# EAGLE schematic DistributedVisionSchematicFINALsch (EAGLE 9.6.2)

## Sheet 1 of 4: Page 1
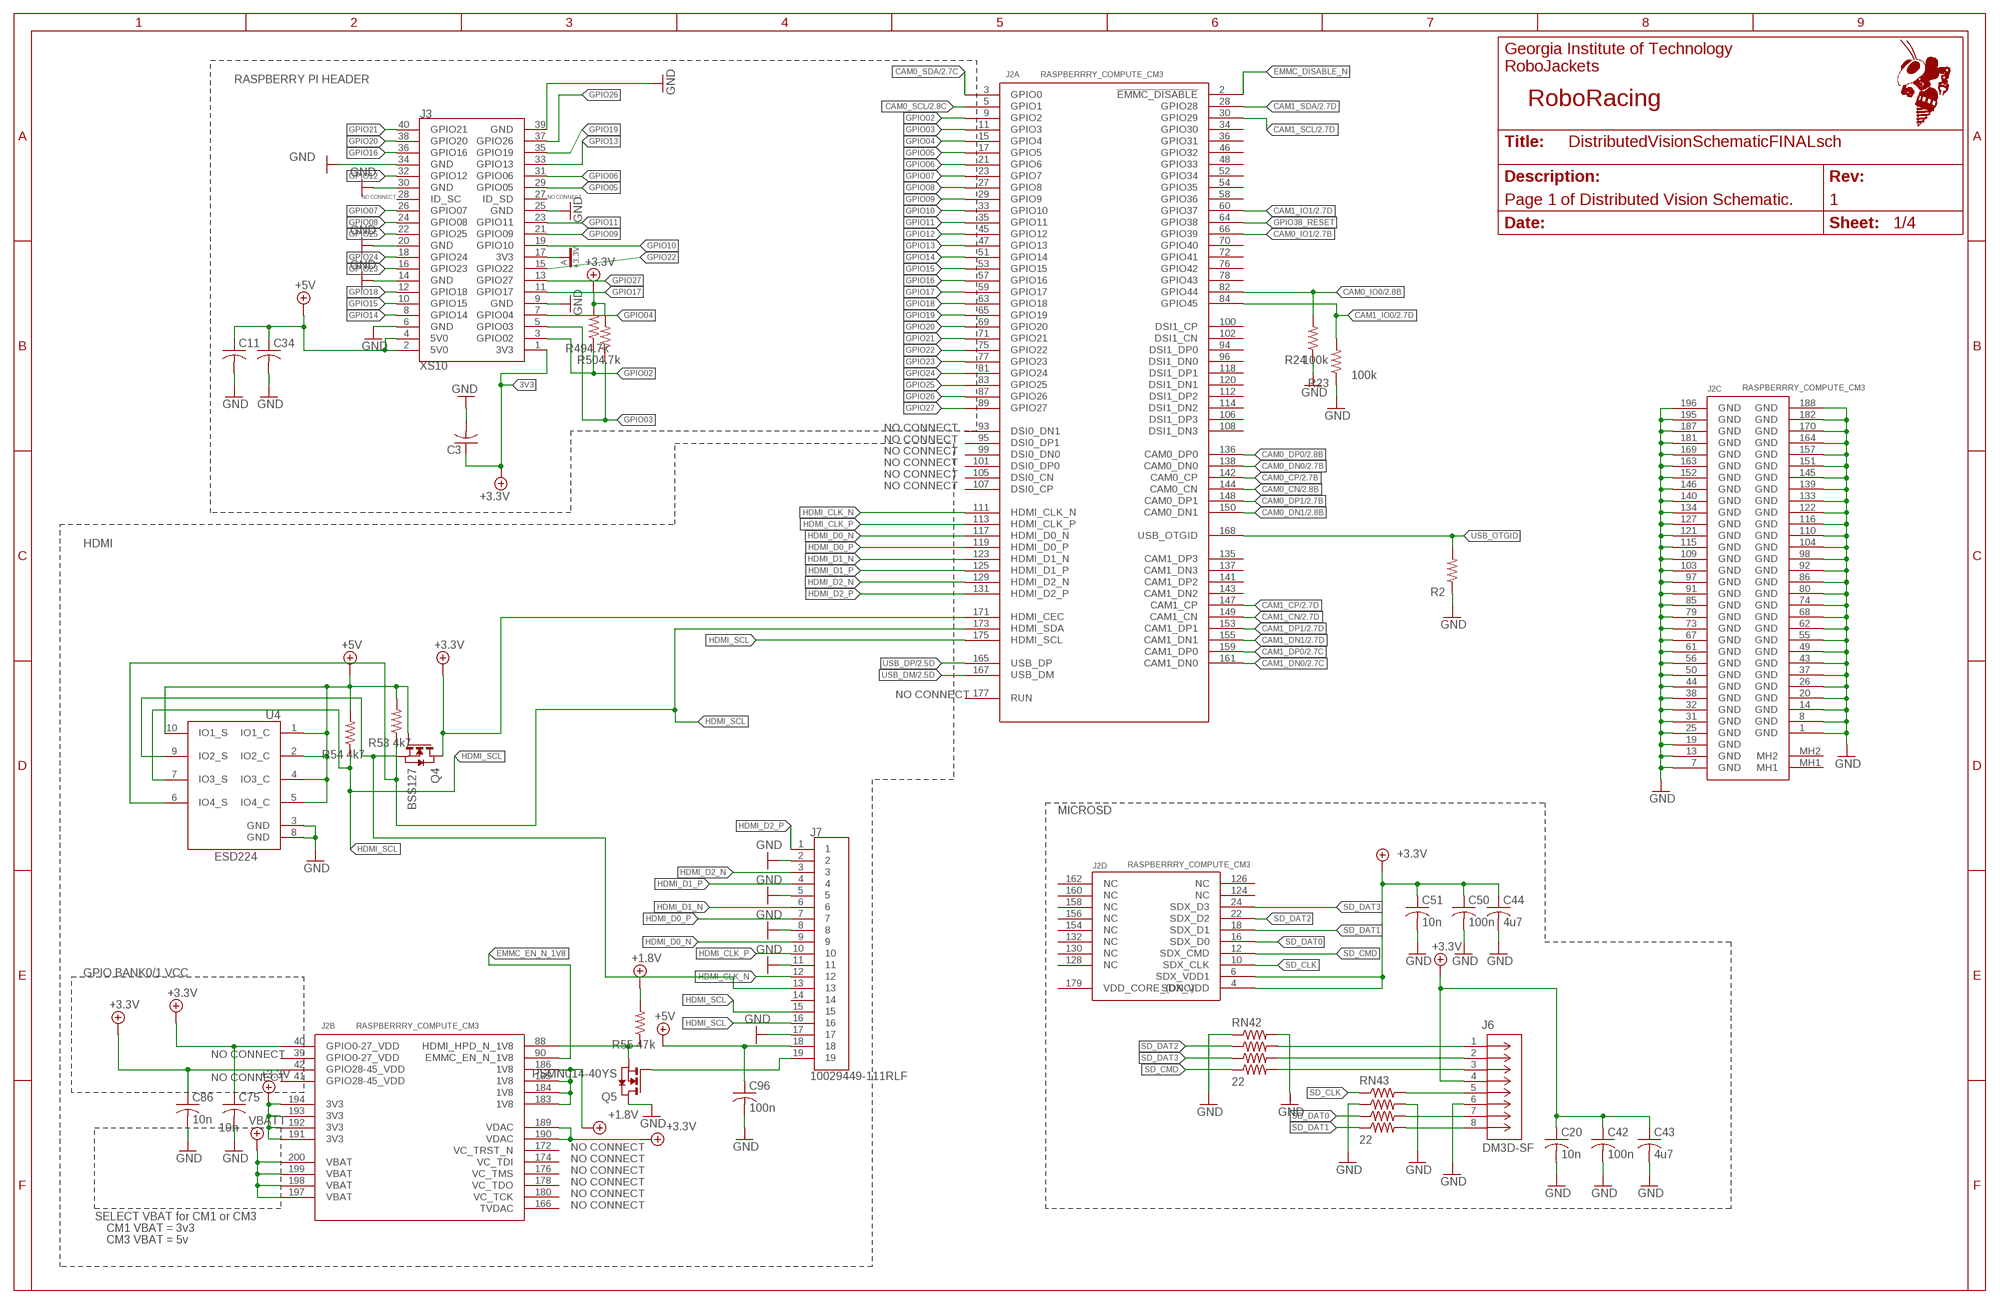
[diagram p0: schematic, sheet 1]
FRAME3 (FRAME_11_17): REVISION: 1; SCH_DESC: Page 1 of Distributed Vision Schematic.; TEAM: RoboRacing

### Parts
C3  C-USC0603  [C0603]
C11  C-USC0603  [C0603]
C20  10n  C-USC0603  [C0603]
C34  C-USC0603  [C0603]
C42  100n  C-USC0603  [C0603]
C43  4u7  C-USC0603  [C0603]
C44  4u7  C-USC0603  [C0603]
C50  100n  C-USC0603  [C0603]
C51  10n  C-USC0603  [C0603]
C75  10n  C-USC0603  [C0603]
C86  10n  C-USC0603  [C0603]
C96  100n  C-USC0603  [C0603]
J2  RASPBERRRY_COMPUTE_CM3  [TE_1473149-4_WITH_CM3PLUS]
J3  XS10  [RASPBERRYPI_BASTELSTUBE_V13_RASPI_BOARD_B+_FULL]
J6  DM3D-SF  [CONN8_DM3D-SF_HIR]
J7  10029449-111RLF  [CONN_1002944111_AMP]
Q4  BSS127  [SOT-23-3]
Q5  PSMN014-40YS  [LFPAK]
R2  R-US_R0603  [R0603]
R23  100k  R-US_R0603  [R0603]
R24  100k  R-US_R0603  [R0603]
R49  4.7k  R-US_R0603  [R0603]
R50  4.7k  R-US_R0603  [R0603]
R53  4k7  R-US_R0603  [R0603]
R54  4k7  R-US_R0603  [R0603]
R55  47k  R-US_R0603  [R0603]
RN42  22  RA-41206  [RA-4_1206]
RN43  22  RA-41206  [RA-4_1206]
U4  ESD224  [USON(10)]

### Nets
3V3: C3.1 J3.1(3V3) ; supply symbol labelled +3.3V
+1.8V: J2.183(B:1V8) J2.184(B:1V8) J2.185(B:1V8) J2.186(B:1V8) R55.2 ; also sheet 3
+3.3V: J2.171(A:HDMI_CEC) J2.189(B:VDAC) J2.190(B:VDAC) Q4.3(D) ; also sheet 2,3,4
+3.3V-A: J3.17(3V3) ; supply symbol labelled SUP ; also sheet 3
+5V: C11.1 C34.1 C96.1 J3.2(5V0) J3.4(5V0) J7.18 Q4.1(G) R53.2 R54.2 U4.1(IO1_C) U4.2(IO2_C) U4.4(IO3_C) U4.5(IO4_C) U4.10(IO1_S) ; also sheet 2,3,4
BD+: J2.88(B:HDMI_HPD_N_1V8) Q5.1(S) Q5.2(S) Q5.3(S) R55.1 ; also sheet 2
CAM0_CN: J2.144(A:CAM0_CN) ; also sheet 2
CAM0_CP: J2.142(A:CAM0_CP) ; also sheet 2
CAM0_DN0: J2.138(A:CAM0_DN0) ; also sheet 2
CAM0_DN1: J2.150(A:CAM0_DN1) ; also sheet 2
CAM0_DP0: J2.136(A:CAM0_DP0) ; also sheet 2
CAM0_DP1: J2.148(A:CAM0_DP1) ; also sheet 2
CAM0_IO0: J2.82(A:GPIO44) R24.2 ; also sheet 2
CAM0_IO1: J2.66(A:GPIO39) ; also sheet 2
CAM0_SCL: J2.5(A:GPIO1) ; also sheet 2
CAM0_SDA: J2.3(A:GPIO0) ; also sheet 2
CAM1_CN: J2.149(A:CAM1_CN) ; also sheet 2
CAM1_CP: J2.147(A:CAM1_CP) ; also sheet 2
CAM1_DN0: J2.161(A:CAM1_DN0) ; also sheet 2
CAM1_DN1: J2.155(A:CAM1_DN1) ; also sheet 2
CAM1_DP0: J2.159(A:CAM1_DP0) ; also sheet 2
CAM1_DP1: J2.153(A:CAM1_DP1) ; also sheet 2
CAM1_IO0: J2.84(A:GPIO45) R23.2 ; also sheet 2
CAM1_IO1: J2.60(A:GPIO37) ; also sheet 2
CAM1_SCL: J2.30(A:GPIO29) ; also sheet 2
CAM1_SDA: J2.28(A:GPIO28) ; also sheet 2
EMMC_DISABLE_N: J2.2(A:!EMMC_DISABLE)
EMMC_EN_N_1V8: J2.90(B:EMMC_EN_N_1V8)
FB1: C20.1 C42.1 C43.1 C44.1 C50.1 C51.1 C75.1 C86.1 J2.4(D:SDX_VDD) J2.6(D:SDX_VDD1) J2.40(B:GPIO0-27_VDD) J2.42(B:GPIO28-45_VDD) J2.191(B:3V3) J2.192(B:3V3) J2.193(B:3V3) J2.194(B:3V3) J6.4 R49.2 R50.2 ; supply symbol labelled +3.3V ; also sheet 3
GND: C3.2 C11.2 C20.2 C34.2 C42.2 C43.2 C44.2 C50.2 C51.2 C75.2 C86.2 C96.2 J2.1(C:GND) J2.7(C:GND) J2.8(C:GND) J2.13(C:GND) J2.14(C:GND) J2.19(C:GND) J2.20(C:GND) J2.25(C:GND) J2.26(C:GND) J2.31(C:GND) J2.32(C:GND) J2.37(C:GND) J2.38(C:GND) J2.43(C:GND) J2.44(C:GND) J2.49(C:GND) J2.50(C:GND) J2.55(C:GND) J2.56(C:GND) J2.61(C:GND) J2.62(C:GND) J2.67(C:GND) J2.68(C:GND) J2.73(C:GND) J2.74(C:GND) J2.79(C:GND) J2.80(C:GND) J2.85(C:GND) J2.86(C:GND) J2.91(C:GND) J2.92(C:GND) J2.97(C:GND) J2.98(C:GND) J2.103(C:GND) J2.104(C:GND) J2.109(C:GND) J2.110(C:GND) J2.115(C:GND) J2.116(C:GND) J2.121(C:GND) J2.122(C:GND) J2.127(C:GND) J2.133(C:GND) J2.134(C:GND) J2.139(C:GND) J2.140(C:GND) J2.145(C:GND) J2.146(C:GND) J2.151(C:GND) J2.152(C:GND) J2.157(C:GND) J2.163(C:GND) J2.164(C:GND) J2.169(C:GND) J2.170(C:GND) J2.181(C:GND) J2.182(C:GND) J2.187(C:GND) J2.188(C:GND) J2.195(C:GND) J2.196(C:GND) J3.6(GND) J3.9(GND) J3.14(GND) J3.20(GND) J3.25(GND) J3.30(GND) J3.34(GND) J3.39(GND) J6.6 J7.2 J7.5 J7.8 J7.11 J7.17 Q5.MB(D) R2.1 R23.1 R24.1 RN42.1 RN42.2 RN43.3 RN43.4 U4.3(GND) U4.8(GND) ; also sheet 2,3,4
GPIO02: J2.9(A:GPIO2) J3.3(GPIO02) R49.1
GPIO03: J2.11(A:GPIO3) J3.5(GPIO03) R50.1
GPIO04: J2.15(A:GPIO4) J3.7(GPIO04)
GPIO05: J2.17(A:GPIO5) J3.29(GPIO05)
GPIO06: J2.21(A:GPIO6) J3.31(GPIO06)
GPIO07: J2.23(A:GPIO7) J3.26(GPIO07)
GPIO08: J2.27(A:GPIO8) J3.24(GPIO08)
GPIO09: J2.29(A:GPIO9) J3.21(GPIO09)
GPIO10: J2.33(A:GPIO10) J3.19(GPIO10)
GPIO11: J2.35(A:GPIO11) J3.23(GPIO11)
GPIO12: J2.45(A:GPIO12) J3.32(GPIO12)
GPIO13: J2.47(A:GPIO13) J3.33(GPIO13)
GPIO14: J2.51(A:GPIO14) J3.8(GPIO14)
GPIO15: J2.53(A:GPIO15) J3.10(GPIO15)
GPIO16: J2.57(A:GPIO16) J3.36(GPIO16)
GPIO17: J2.59(A:GPIO17) J3.11(GPIO17)
GPIO18: J2.63(A:GPIO18) J3.12(GPIO18)
GPIO19: J2.65(A:GPIO19) J3.35(GPIO19)
GPIO20: J2.69(A:GPIO20) J3.38(GPIO20)
GPIO21: J2.71(A:GPIO21) J3.40(GPIO21)
GPIO22: J2.75(A:GPIO22) J3.15(GPIO22)
GPIO23: J2.77(A:GPIO23) J3.16(GPIO23)
GPIO24: J2.81(A:GPIO24) J3.18(GPIO24)
GPIO25: J2.83(A:GPIO25) J3.22(GPIO25)
GPIO26: J2.87(A:GPIO26) J3.37(GPIO26)
GPIO27: J2.89(A:GPIO27) J3.13(GPIO27)
GPIO38_RESET: J2.64(A:GPIO38)
HDMI_CLK_N: J2.111(A:HDMI_CLK_N) J7.12
HDMI_CLK_P: J2.113(A:HDMI_CLK_P) J7.10
HDMI_D0_N: J2.117(A:HDMI_D0_N) J7.9
HDMI_D0_P: J2.119(A:HDMI_D0_P) J7.7
HDMI_D1_N: J2.123(A:HDMI_D1_N) J7.6
HDMI_D1_P: J2.125(A:HDMI_D1_P) J7.4
HDMI_D2_N: J2.129(A:HDMI_D2_N) J7.3
HDMI_D2_P: J2.131(A:HDMI_D2_P) J7.1
HDMI_SCL: J2.173(A:HDMI_SDA) J2.175(A:HDMI_SCL) J7.15 J7.16 R53.1 R54.1 U4.6(IO4_S) U4.7(IO3_S)
N$45: J7.19 Q5.4(G)
N$46: J6.1 RN42.4
N$47: J6.2 RN42.6
N$48: J6.3 RN42.8
N$49: J6.5 RN43.2
N$50: J6.7 RN43.6
N$51: J6.8 RN43.8
N$53: J7.13 Q4.2(S) U4.9(IO2_S)
SD_CLK: J2.10(D:SDX_CLK) RN43.1
SD_CMD: J2.12(D:SDX_CMD) RN42.7
SD_DAT0: J2.16(D:SDX_D0) RN43.5
SD_DAT1: J2.18(D:SDX_D1) RN43.7
SD_DAT2: J2.22(D:SDX_D2) RN42.3
SD_DAT3: J2.24(D:SDX_D3) RN42.5
USB_DM: J2.167(A:USB_DM) ; also sheet 2
USB_DP: J2.165(A:USB_DP) ; also sheet 2
USB_OTGID: J2.168(A:USB_OTGID) R2.2
VBATT: J2.197(B:VBAT) J2.198(B:VBAT) J2.199(B:VBAT) J2.200(B:VBAT) ; also sheet 3
Unconnected: J2.34(A:GPIO30) J2.36(A:GPIO31) J2.46(A:GPIO32) J2.48(A:GPIO33) J2.52(A:GPIO34) J2.54(A:GPIO35) J2.58(A:GPIO36) J2.70(A:GPIO40) J2.72(A:GPIO41) J2.76(A:GPIO42) J2.78(A:GPIO43) J2.93(A:DSI0_DN1) J2.94(A:DSI1_DP0) J2.95(A:DSI0_DP1) J2.96(A:DSI1_DN0) J2.99(A:DSI0_DN0) J2.100(A:DSI1_CP) J2.101(A:DSI0_DP0) J2.102(A:DSI1_CN) J2.105(A:DSI0_CN) J2.106(A:DSI1_DP3) J2.107(A:DSI0_CP) J2.108(A:DSI1_DN3) J2.112(A:DSI1_DP2) J2.114(A:DSI1_DN2) J2.118(A:DSI1_DP1) J2.120(A:DSI1_DN1) J2.124(D:NC) J2.126(D:NC) J2.128(D:NC) J2.130(D:NC) J2.132(D:NC) J2.135(A:CAM1_DP3) J2.137(A:CAM1_DN3) J2.141(A:CAM1_DP2) J2.143(A:CAM1_DN2) J2.154(D:NC) J2.156(D:NC) J2.158(D:NC) J2.160(D:NC) J2.162(D:NC) J2.166(B:TVDAC) J2.172(B:VC_TRST_N) J2.174(B:VC_TDI) J2.176(B:VC_TMS) J2.177(A:RUN) J2.179(D:VDD_CORE_(DNC)) J2.MH1(C:MH1) J2.MH2(C:MH2) J3.27(ID_SD) J3.28(ID_SC) J7.14

### Notes on the sheet
- RASPBERRY PI HEADER
- NO CONNECT | NO CONNECT
- NO CONNECT
- NO CONNECT
- NO CONNECT
- NO CONNECT
- NO CONNECT
- NO CONNECT
- HDMI
- NO CONNECT
- MICROSD
- GPIO BANK0/1 VCC
- NO CONNECT
- NO CONNECT
- NO CONNECT
- NO CONNECT
- NO CONNECT
- NO CONNECT
- NO CONNECT
- NO CONNECT
- SELECT VBAT for CM1 or CM3
- CM1 VBAT = 3v3
- CM3 VBAT = 5v

## Sheet 2 of 4
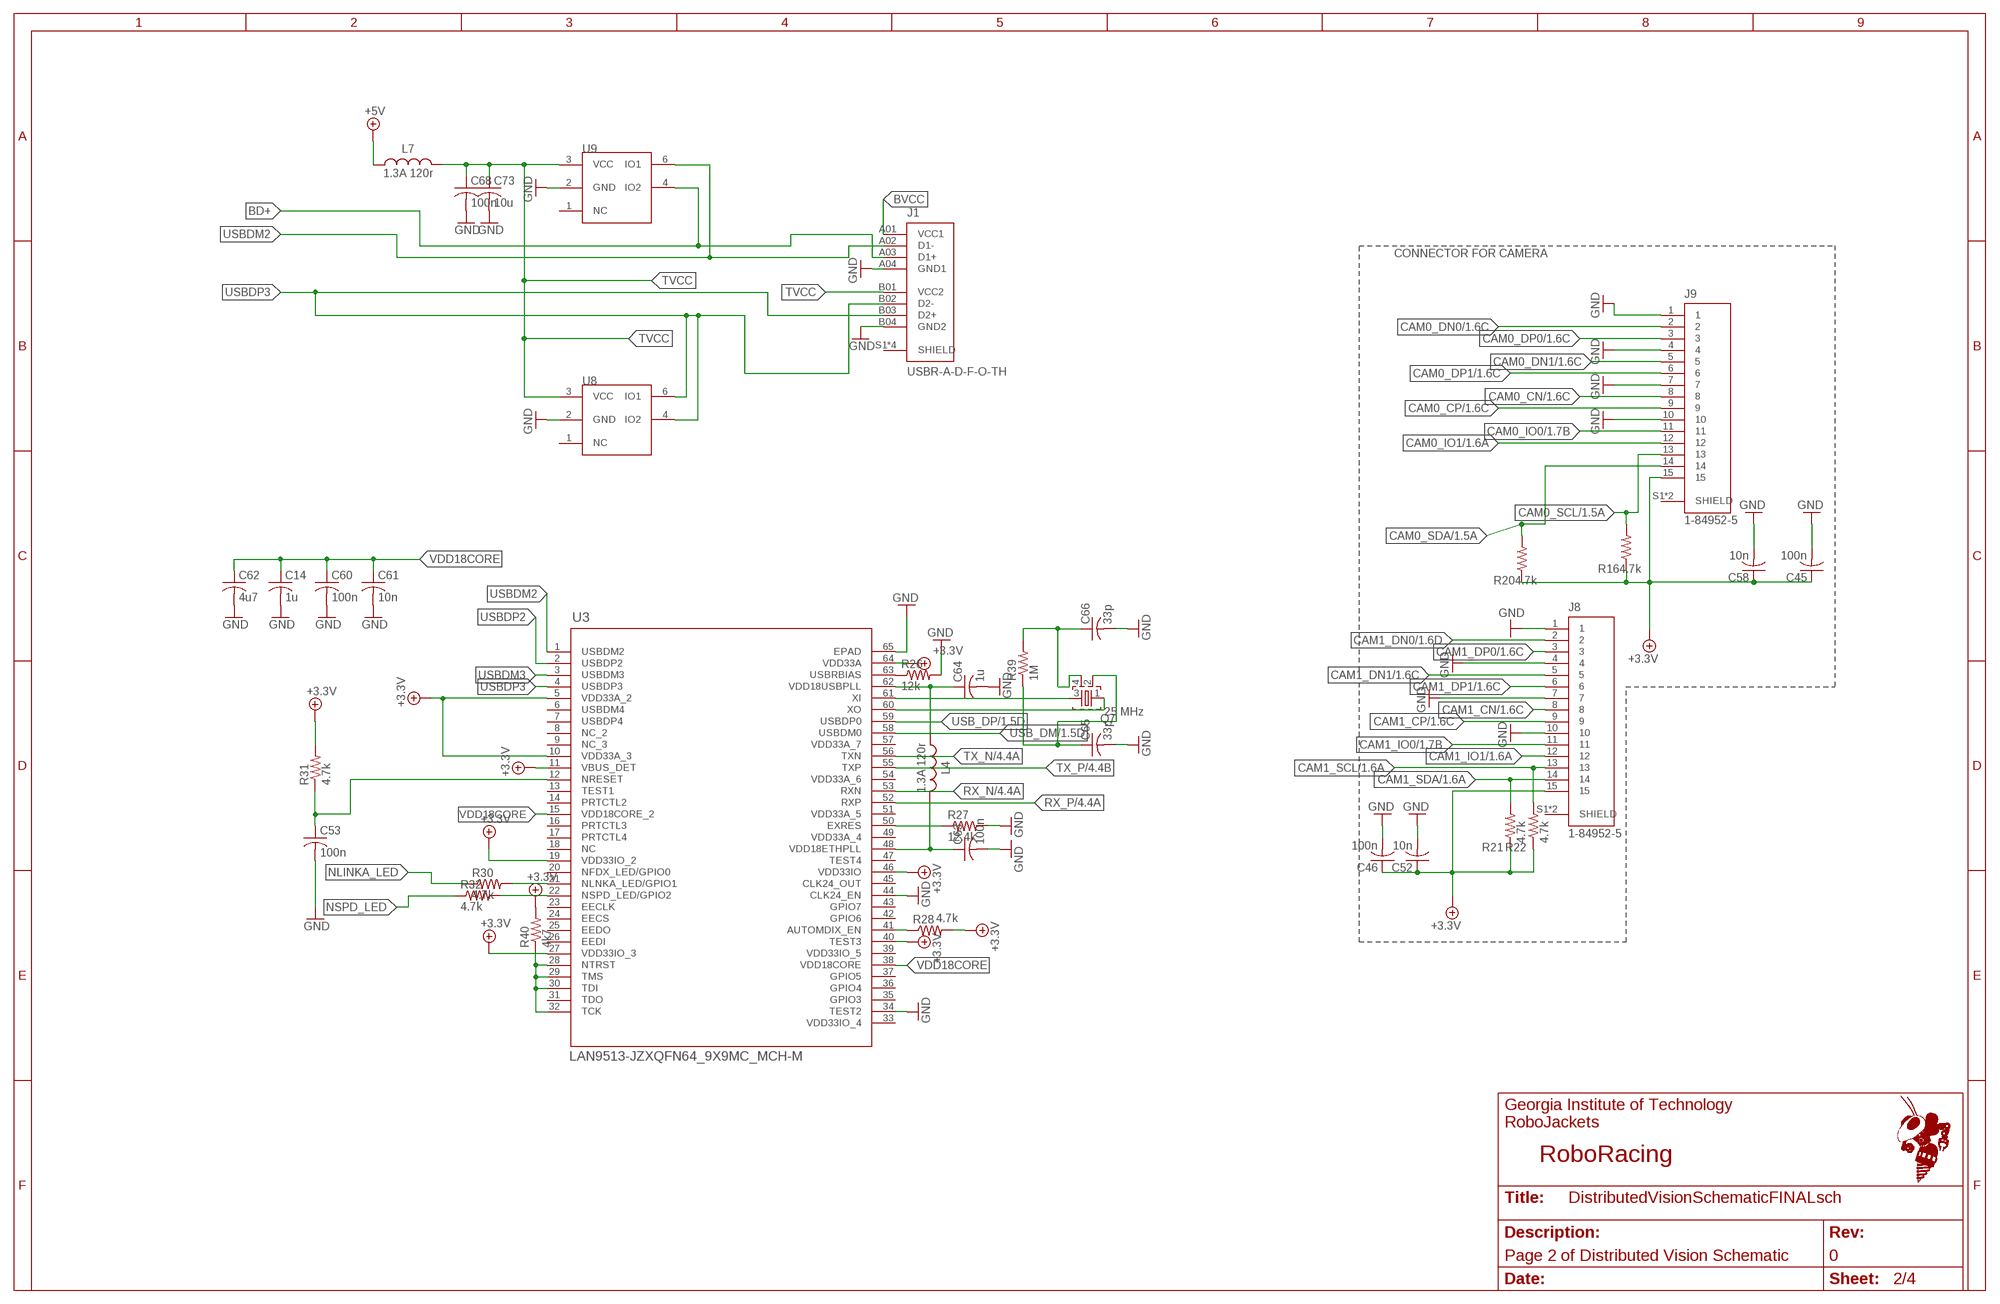
[diagram p1: schematic, sheet 2]
FRAME1 (FRAME_11_17): REVISION: 0; SCH_DESC: Page 2 of Distributed Vision Schematic; TEAM: RoboRacing

### Parts
C14  1u  C-USC0402  [C0402]
C45  100n  C-USC0603  [C0603]
C46  100n  C-USC0603  [C0603]
C52  10n  C-USC0603  [C0603]
C53  100n  C-USC0402  [C0402]
C58  10n  C-USC0603  [C0603]
C60  100n  C-USC0402  [C0402]
C61  10n  C-USC0402  [C0402]
C62  4u7  C-USC0402  [C0402]
C63  100n  C-USC0402  [C0402]
C64  1u  C-USC0402  [C0402]
C65  33p  C-USC0402  [C0402]
C66  33p  C-USC0402  [C0402]
C68  100n  C-USC0402  [C0402]
C73  10u  C-USC0402  [C0402]
J1  USBR-A-D-F-O-TH  [SAMTEC_USBR-A-D-F-O-TH]
J8  1-84952-5  [TE_1-84952-5]
J9  1-84952-5  [TE_1-84952-5]
L4  1.3A 120r  INDUCTOR_0805  [0805]
L7  1.3A 120r  INDUCTOR_0805  [0805]
Q7  25 MHz  FA-20H  [FA-20H]
R16  4.7k  R-US_R0603  [R0603]
R20  4.7k  R-US_R0603  [R0603]
R21  4.7k  R-US_R0603  [R0603]
R22  4.7k  R-US_R0603  [R0603]
R26  12k  ERJ-L06KF50MV  [RC0805N]
R27  12.4k  ERJ-L06KF50MV  [RC0805N]
R28  4.7k  ERJ-L06KF50MV  [RC0805N]
R30  4.7k  ERJ-L06KF50MV  [RC0805N]
R31  4.7k  ERJ-L06KF50MV  [RC0805N]
R32  4.7k  ERJ-L06KF50MV  [RC0805N]
R39  1M  ERJ-L06KF50MV  [RC0805N]
R40  4k7  ERJ-L06KF50MV  [RC0805N]
U3  LAN9513-JZXQFN64_9X9MC_MCH-M  [QFN64_9X9MC_MCH-M]
U8  SP3003-02  [SC70-5]
U9  SP3003-02  [SC70-5]

### Nets
+3.3V: C45.1 C46.1 C52.1 C58.1 J8.15 J9.15 R16.1 R20.1 R21.1 R22.1 R28.2(PIN2) R31.2(PIN2) R40.2(PIN2) U3.5(VDD33A_2) U3.10(VDD33A_3) U3.11(VBUS_DET) U3.19(VDD33IO_2) U3.27(VDD33IO_3) U3.40(TEST3) U3.46(VDD33IO) U3.64(VDD33A) ; also sheet 1,3,4
+5V: L7.1 ; also sheet 1,3,4
BD+: J1.A03(D1+) U9.4(IO2) ; also sheet 1
BVCC: J1.A01(VCC1) ; also sheet 3
CAM0_CN: J9.8 ; also sheet 1
CAM0_CP: J9.9 ; also sheet 1
CAM0_DN0: J9.2 ; also sheet 1
CAM0_DN1: J9.5 ; also sheet 1
CAM0_DP0: J9.3 ; also sheet 1
CAM0_DP1: J9.6 ; also sheet 1
CAM0_IO0: J9.11 ; also sheet 1
CAM0_IO1: J9.12 ; also sheet 1
CAM0_SCL: J9.13 R16.2 ; also sheet 1
CAM0_SDA: J9.14 R20.2 ; also sheet 1
CAM1_CN: J8.8 ; also sheet 1
CAM1_CP: J8.9 ; also sheet 1
CAM1_DN0: J8.2 ; also sheet 1
CAM1_DN1: J8.5 ; also sheet 1
CAM1_DP0: J8.3 ; also sheet 1
CAM1_DP1: J8.6 ; also sheet 1
CAM1_IO0: J8.11 ; also sheet 1
CAM1_IO1: J8.12 ; also sheet 1
CAM1_SCL: J8.13 R22.2 ; also sheet 1
CAM1_SDA: J8.14 R21.2 ; also sheet 1
GND: C14.2 C45.2 C46.2 C52.2 C53.2 C58.2 C60.2 C61.2 C62.2 C63.2 C64.2 C65.2 C66.2 C68.2 C73.2 J1.A04(GND1) J1.B04(GND2) J8.1 J8.4 J8.7 J8.10 J9.1 J9.4 J9.7 J9.10 R26.2(PIN2) R27.2(PIN2) U3.34(TEST2) U3.44(CLK24_EN) U3.65(EPAD) U8.2(GND) U9.2(GND) ; also sheet 1,3,4
N$55: C64.1 L4.1 U3.62(VDD18USBPLL)
N$56: C63.1 L4.2 U3.48(VDD18ETHPLL)
N$58: R30.2(PIN2) U3.21(NLNKA_LED/GPIO1)
N$59: R32.2(PIN2) U3.22(NSPD_LED/GPIO2)
N$61: C53.1 R31.1(PIN1) U3.12(NRESET)
N$63: R40.1(PIN1) U3.28(NTRST) U3.29(TMS) U3.30(TDI) U3.32(TCK)
N$64: Q7.3 U3.61(XI)
N$65: Q7.1 U3.60(XO)
N$66: C66.1 Q7.4 R39.2(PIN2)
N$67: C65.1 Q7.2 R39.1(PIN1)
N$69: R26.1(PIN1) U3.63(USBRBIAS)
N$70: R28.1(PIN1) U3.41(AUTOMDIX_EN)
N$71: R27.1(PIN1) U3.50(EXRES)
NLINKA_LED: R30.1(PIN1)
NSPD_LED: R32.1(PIN1)
RX_N [ethernet]: U3.53(RXN) ; also sheet 3,4
RX_P [ethernet]: U3.52(RXP) ; also sheet 3,4
TVCC: C68.1 C73.1 J1.B01(VCC2) L7.2 U8.3(VCC) U9.3(VCC)
TX_N [ethernet]: U3.56(TXN) ; also sheet 4
TX_P [ethernet]: U3.55(TXP) ; also sheet 4
USB_DM: U3.58(USBDM0) ; also sheet 1
USB_DP: U3.59(USBDP0) ; also sheet 1
USBDM2: J1.A02(D1-) U3.1(USBDM2) U9.6(IO1)
USBDM3: U3.3(USBDM3)
USBDP2: U3.2(USBDP2)
USBDP3: J1.B02(D2-) J1.B03(D2+) U3.4(USBDP3) U8.4(IO2) U8.6(IO1)
VDD18CORE: C14.1 C60.1 C61.1 C62.1 U3.15(VDD18CORE_2) U3.38(VDD18CORE) ; also sheet 3
Unconnected: J1.S1(SHIELD) J1.S2(SHIELD) J1.S3(SHIELD) J1.S4(SHIELD) J8.S1(SHIELD) J8.S2(SHIELD) J9.S1(SHIELD) J9.S2(SHIELD) U3.6(USBDM4) U3.7(USBDP4) U3.8(NC_2) U3.9(NC_3) U3.13(TEST1) U3.14(PRTCTL2) U3.16(PRTCTL3) U3.17(PRTCTL4) U3.18(NC) U3.20(NFDX_LED/GPIO0) U3.23(EECLK) U3.24(EECS) U3.25(EEDO) U3.26(EEDI) U3.31(TDO) U3.35(GPIO3) U3.36(GPIO4) U3.37(GPIO5) U3.42(GPIO6) U3.43(GPIO7) U3.45(CLK24_OUT) U3.47(TEST4) U8.1(NC) U9.1(NC)

### Notes on the sheet
- CONNECTOR FOR CAMERA

## Sheet 3 of 4: Page 3
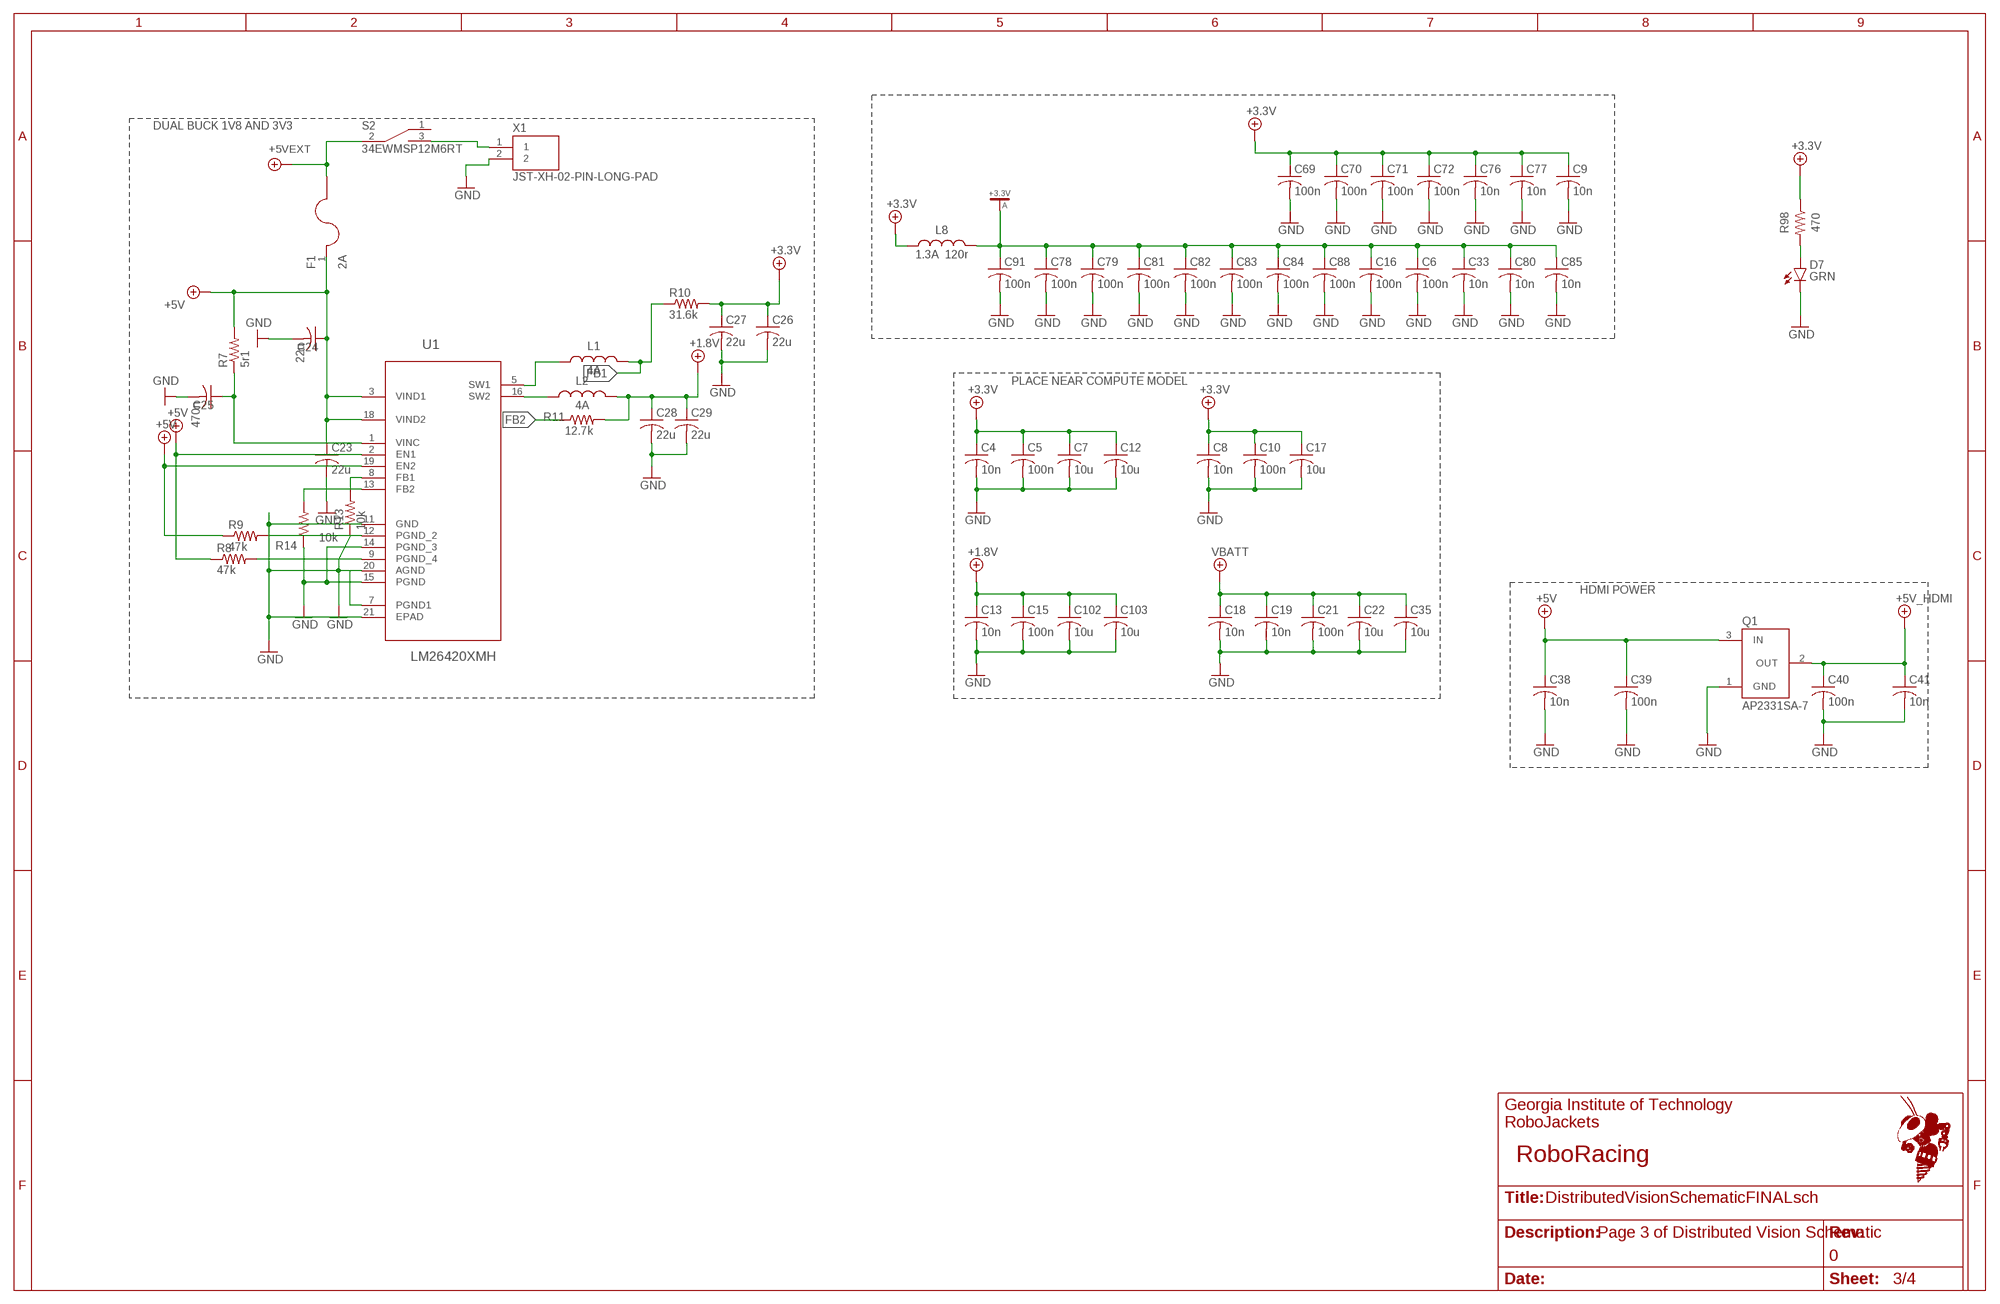
[diagram p2: schematic, sheet 3]
FRAME2 (FRAME_11_17): REVISION: 0; SCH_DESC: Page 3 of Distributed Vision Schematic; TEAM: RoboRacing

### Parts
C4  10n  C-USC0603  [C0603]
C5  100n  C-USC0603  [C0603]
C6  100n  C-USC0603  [C0603]
C7  10u  C-USC0603  [C0603]
C8  10n  C-USC0603  [C0603]
C9  10n  C-USC0603  [C0603]
C10  100n  C-USC0603  [C0603]
C12  10u  C-USC0603  [C0603]
C13  10n  C-USC0603  [C0603]
C15  100n  C-USC0603  [C0603]
C16  100n  C-USC0603  [C0603]
C17  10u  C-USC0603  [C0603]
C18  10n  C-USC0603  [C0603]
C19  10n  C-USC0603  [C0603]
C21  100n  C-USC0603  [C0603]
C22  10u  C-USC0603  [C0603]
C23  22u  C-USC0603  [C0603]
C24  22u  C-USC0603  [C0603]
C25  470n  C-USC0603  [C0603]
C26  22u  C-USC0805  [C0805]
C27  22u  C-USC0805  [C0805]
C28  22u  C-USC0805  [C0805]
C29  22u  C-USC0805  [C0805]
C33  10n  C-USC0603  [C0603]
C35  10u  C-USC0603  [C0603]
C38  10n  C-USC0603  [C0603]
C39  100n  C-USC0603  [C0603]
C40  100n  C-USC0603  [C0603]
C41  10n  C-USC0603  [C0603]
C69  100n  C-USC0603  [C0603]
C70  100n  C-USC0603  [C0603]
C71  100n  C-USC0603  [C0603]
C72  100n  C-USC0603  [C0603]
C76  10n  C-USC0603  [C0603]
C77  10n  C-USC0603  [C0603]
C78  100n  C-USC0603  [C0603]
C79  100n  C-USC0603  [C0603]
C80  10n  C-USC0603  [C0603]
C81  100n  C-USC0603  [C0603]
C82  100n  C-USC0603  [C0603]
C83  100n  C-USC0603  [C0603]
C84  100n  C-USC0603  [C0603]
C85  10n  C-USC0603  [C0603]
C88  100n  C-USC0603  [C0603]
C91  100n  C-USC0603  [C0603]
C102  10u  C-USC0603  [C0603]
C103  10u  C-USC0603  [C0603]
D7  GRN  LEDCHIP-LED0603  [CHIP-LED0603]
F1  2A  PTCFUSE-1812  [1812]
L1  4A  INDUCTOR_0805  [0805]
L2  4A  INDUCTOR_0805  [0805]
L8  1.3A 120r  INDUCTOR_0805  [0805]
Q1  AP2331SA-7  [SOT23]
R7  5r1  R-US_R0603  [R0603]
R8  47k  R-US_R0603  [R0603]
R9  47k  R-US_R0603  [R0603]
R10  31.6k  R-US_R0603  [R0603]
R11  12.7k  R-US_R0603  [R0603]
R13  10k  R-US_R0603  [R0603]
R14  10k  R-US_R0603  [R0603]
R98  470  R-US_R0603  [R0603]
S2  34EWMSP12M6RT  [34EWMSP12M6RT]
U1  LM26420XMH  [SOP65P640X175-21N]
X1  JST-XH-02-PIN-LONG-PAD  [JST-XH-02-PACKAGE-LONG-PAD]

### Nets
3V3_LED: D7.A R98.2
+1.8V: C13.1 C15.1 C102.1 C103.1 ; also sheet 1
+3.3V: C4.1 C5.1 C7.1 C8.1 C10.1 C12.1 C17.1 C26.1 C27.1 R10.2 R98.1 ; also sheet 1,2,4
+3.3V-A: C6.1 C16.1 C33.1 C78.1 C79.1 C80.1 C81.1 C82.1 C83.1 C84.1 C85.1 C88.1 C91.1 L8.2 ; supply symbol labelled SUP ; also sheet 1
+5V: C23.1 C24.1 C38.1 C39.1 C40.1 C41.1 F1.1 Q1.2(OUT) Q1.3(IN) R7.2 R9.1 U1.3(VIND1) U1.18(VIND2) U1.19(EN2) ; supply symbol labelled +5V_HDMI ; also sheet 1,2,4
+5VEXT: F1.2 S2.2(COMMON) ; supply symbol labelled +5V
BVCC: S2.3(B) X1.1 ; also sheet 2
FB1: C9.1 C69.1 C70.1 C71.1 C72.1 C76.1 C77.1 L1.2 L8.1 R10.1 ; supply symbol labelled +3.3V ; also sheet 1
FB2: C28.1 C29.1 L2.2 R11.2 ; supply symbol labelled +1.8V
GND: C4.2 C5.2 C6.2 C7.2 C8.2 C9.2 C10.2 C12.2 C13.2 C15.2 C16.2 C17.2 C18.2 C19.2 C21.2 C22.2 C23.2 C24.2 C25.2 C26.2 C27.2 C28.2 C29.2 C33.2 C35.2 C38.2 C39.2 C40.2 C41.2 C69.2 C70.2 C71.2 C72.2 C76.2 C77.2 C78.2 C79.2 C80.2 C81.2 C82.2 C83.2 C84.2 C85.2 C88.2 C91.2 C102.2 C103.2 D7.C Q1.1(GND) R13.1 R14.1 U1.7(PGND1) U1.11(GND) U1.14(PGND_3) U1.15(PGND) U1.20(AGND) U1.21(EPAD) X1.2 ; also sheet 1,2,4
N$1: R11.1
N$2: R8.1 U1.2(EN1) ; supply symbol labelled +5V
N$5: C25.1 R7.1 U1.1(VINC)
N$40: R8.2 U1.9(PGND_4)
RX_N [ethernet]: L1.1 U1.5(SW1) ; also sheet 2,4
RX_P [ethernet]: R9.2 U1.12(PGND_2) ; also sheet 2,4
USBDM4: L2.1 U1.16(SW2)
USBDP4: R14.2 U1.13(FB2)
VBATT: C18.1 C19.1 C21.1 C22.1 C35.1 ; also sheet 1
VDD18CORE: R13.2 U1.8(FB1) ; also sheet 2
Unconnected: S2.1(A) S2.LEG1 S2.LEG3(LEG2)

### Notes on the sheet
- DUAL BUCK 1V8 AND 3V3
- PLACE NEAR COMPUTE MODEL
- HDMI POWER

## Sheet 4 of 4
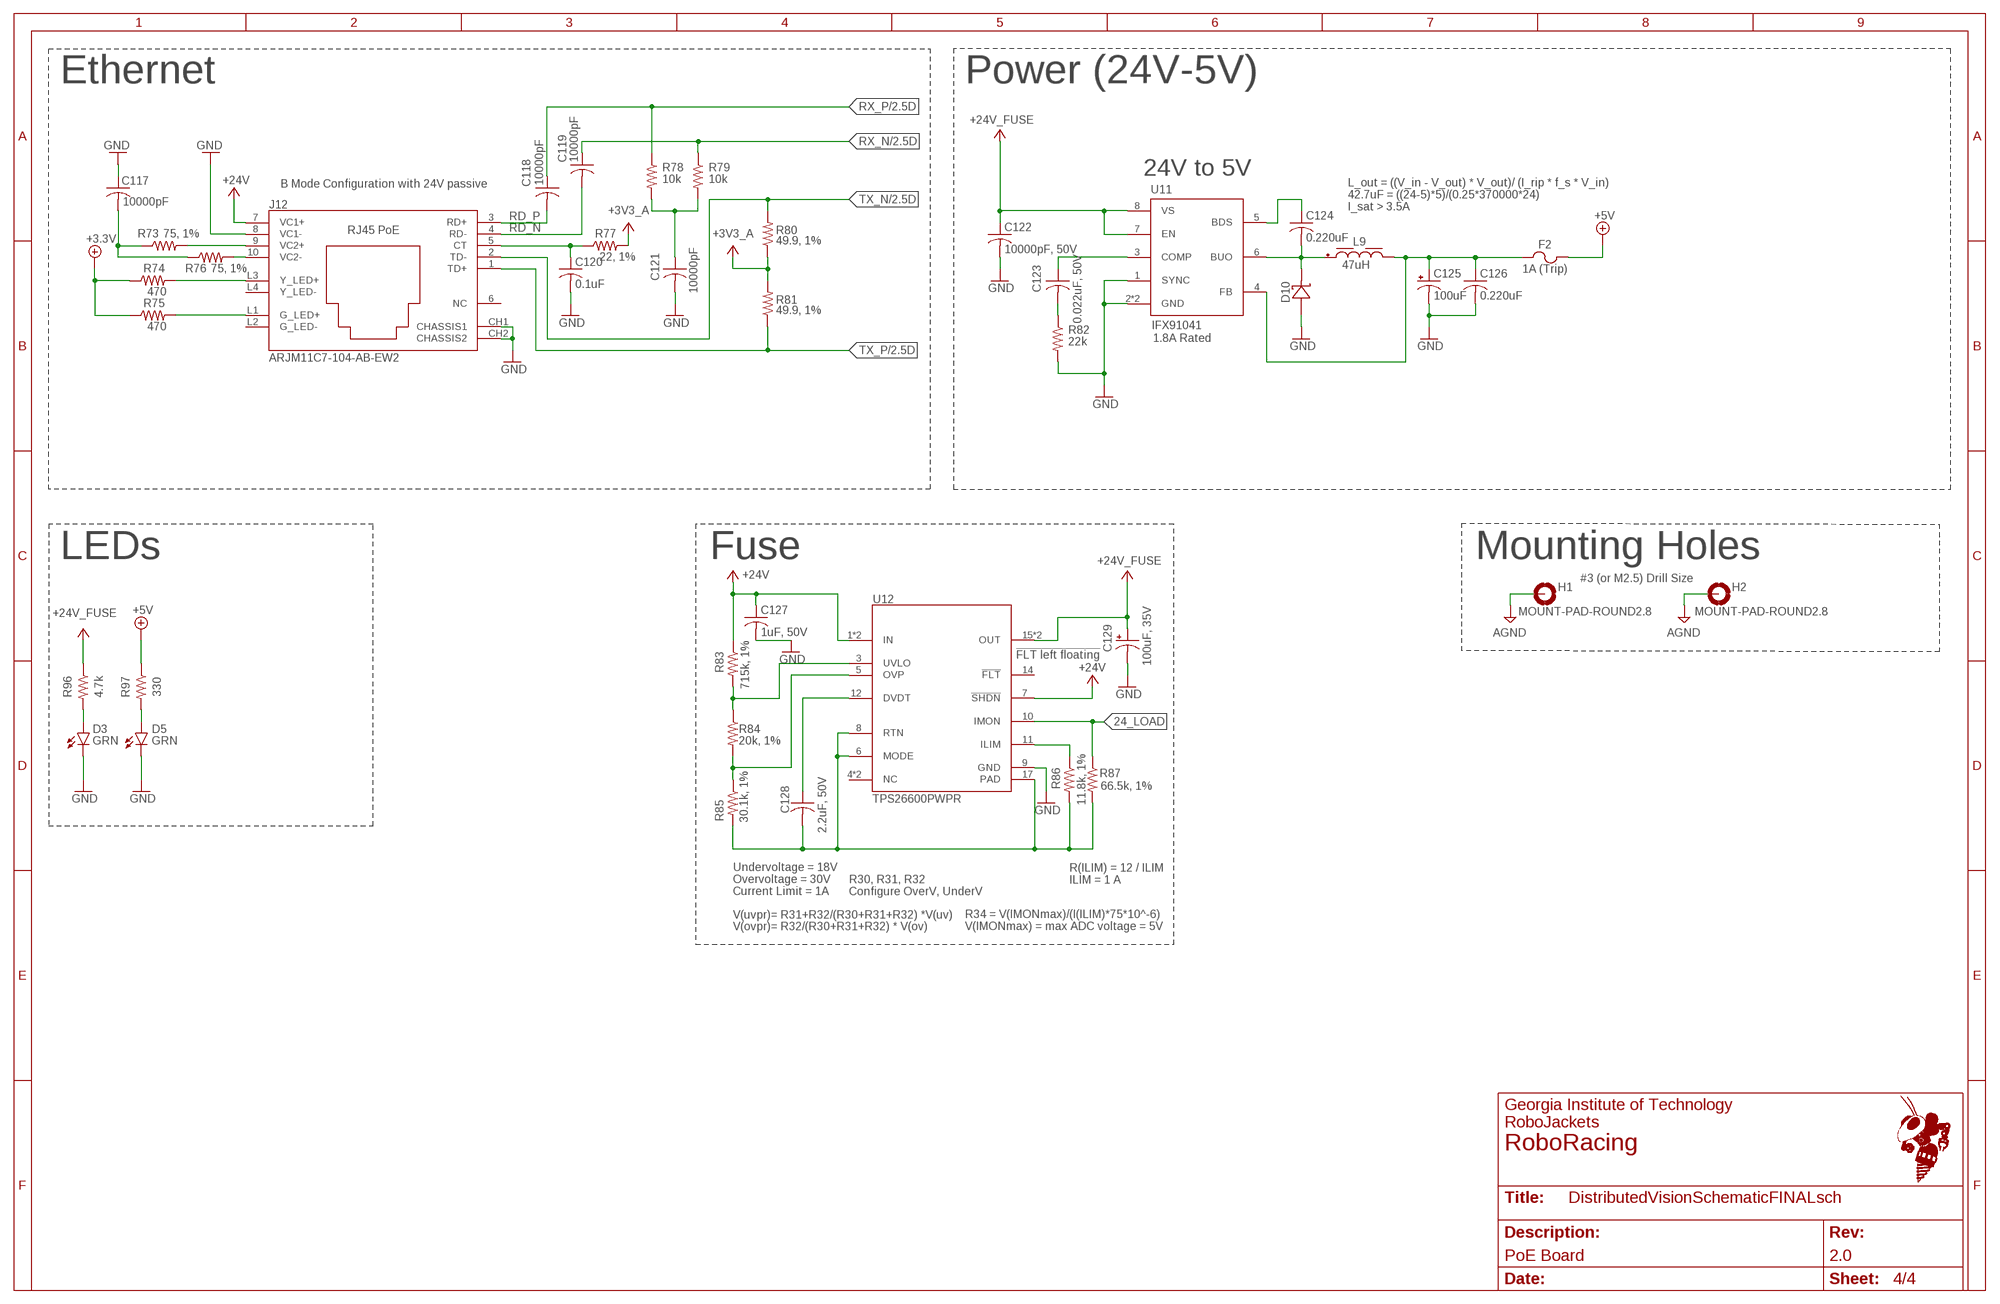
[diagram p3: schematic, sheet 4]
FRAME4 (FRAME_11_17): REVISION: 2.0; SCH_DESC: PoE Board; TEAM: RoboRacing

### Parts
C117  10000pF  C-USC0603  [C0603]
C118  10000pF  C-USC0402  [C0402]
C119  10000pF  C-USC0402  [C0402]
C120  0.1uF  C-USC0402  [C0402]
C121  10000pF  C-USC0603  [C0603]
C122  10000pF, 50V  C-USC0603  [C0603]
C123  0.022uF, 50V  C-USC0603  [C0603]
C124  0.220uF  C-USC0603  [C0603]
C125  100uF  CPOL-USE2-5  [E2-5]
C126  0.220uF  C-USC0603  [C0603]
C127  1uF, 50V  C-USC0603  [C0603]
C128  2.2uF, 50V  C-USC0603  [C0603]
C129  100uF, 35V  CPOL-USE2.5-7  [E2,5-7]
D3  GRN  LEDCHIP-LED0603  [CHIP-LED0603]
D5  GRN  LEDCHIP-LED0603  [CHIP-LED0603]
D10  NTS260ESFT3G  [SOD123FL_DIO]
F2  1A (Trip)  0ZCG0050AF2C  [0ZCG_BEL]
H1  MOUNT-PAD-ROUND2.8  [2,8-PAD]
H2  MOUNT-PAD-ROUND2.8  [2,8-PAD]
J12  ARJM11C7-104-AB-EW2  [CONN_EW_ABR]
L9  47uH  7447709470_7447709470  [WE-PD_1210]
R73  75, 1%  R-US_R0603  [R0603]
R74  470  R-US_R0603  [R0603]
R75  470  R-US_R0603  [R0603]
R76  75, 1%  R-US_R0603  [R0603]
R77  22, 1%  R-US_R0603  [R0603]
R78  10k  R-US_R0603  [R0603]
R79  10k  R-US_R0603  [R0603]
R80  49.9, 1%  R-US_R0402  [R0402]
R81  49.9, 1%  R-US_R0402  [R0402]
R82  22k  R-US_R0603  [R0603]
R83  715k, 1%  R-US_R0603  [R0603]
R84  20k, 1%  R-US_R0603  [R0603]
R85  30.1k, 1%  R-US_R0603  [R0603]
R86  11.8k, 1%  R-US_R0603  [R0603]
R87  66.5k, 1%  R-US_R0603  [R0603]
R96  4.7k  R-US_R0603  [R0603]
R97  330  R-US_R0603  [R0603]
U11  IFX91041  [SOIC-8-EXPOSED_PAD]
U12  TPS26600PWPR  [PWP0016H_N]

### Nets
5V_LED: D5.A R97.2
5V_RAW: C124.2 D10.1 L9.1 U11.6(BUO)
24_LOAD: R87.1 U12.10(IMON)
24V_LED: D3.A R96.2
+3.3V: R74.1 R75.1 ; also sheet 1,2,3
+3V3_A: R77.2 R80.1 R81.2
+5V: F2.2 R97.1 ; also sheet 1,2,3
+5V_PREFUSE: C125.+ C126.1 F2.1 L9.2 U11.4(FB)
+24V: C127.1 J12.7(VC1+) R83.1 U12.1(IN) U12.2(IN) U12.7(!SHDN)
+24V_FUSE: C122.1 C129.+ R96.1 U11.7(EN) U11.8(VS) U12.15(OUT) U12.16(OUT)
AGND: H1.B2,8(MOUNT) H2.B2,8(MOUNT)
CT: C120.1 J12.5(CT) R77.1
G_LED+: J12.L1(G_LED+) R75.2
GND: C117.1 C120.2 C121.2 C122.2 C125.- C126.2 C127.2 C129.- D3.C D5.C D10.2 J12.8(VC1-) J12.CH1(CHASSIS1) J12.CH2(CHASSIS2) R82.2 U11.1(SYNC) U11.2(GND) U11.9(GND) U12.9(GND) ; also sheet 1,2,3
N$4: C123.1 U11.3(COMP)
N$10: J12.9(VC2+) R73.2
N$14: J12.10(VC2-) R76.2
N$15: C124.1 U11.5(BDS)
N$16: C123.2 R82.1
N$20: C117.2 R73.1 R76.1
N$25: R83.2 R84.1 U12.3(UVLO)
N$28: R84.2 R85.1 U12.5(OVP)
N$29: C128.1 U12.12(DVDT)
N$34 [power]: R86.1 U12.11(ILIM)
RD_N [ethernet]: C119.2 J12.4(RD-)
RD_P [ethernet]: C118.2 J12.3(RD+)
RTN: C128.2 R85.2 R86.2 R87.2 U12.6(MODE) U12.8(RTN) U12.17(PAD)
RX_FILTER: C121.1 R78.2 R79.2
RX_N [ethernet]: C119.1 R79.1 ; also sheet 2,3
RX_P [ethernet]: C118.1 R78.1 ; also sheet 2,3
TX_N [ethernet]: J12.2(TD-) R80.2 ; also sheet 2
TX_P [ethernet]: J12.1(TD+) R81.1 ; also sheet 2
Y_LED+: J12.L3(Y_LED+) R74.2
Unconnected: J12.6(NC) J12.L2(G_LED-) J12.L4(Y_LED-) U12.4(NC) U12.13(NC) U12.14(!FLT)

### Notes on the sheet
- Ethernet | Power (24V-5V)
- 24V to 5V
- B Mode Configuration with 24V passive
- L_out = ((V_in - V_out) * V_out)/ (I_rip * f_s * V_in)
  42.7uF = ((24-5)*5)/(0.25*370000*24)
  I_sat > 3.5A
- 1.8A Rated
- LEDs | Fuse | Mounting Holes
- #3 (or M2.5) Drill Size
- !FLT left floating
- R(ILIM) = 12 / ILIM
  ILIM = 1 A
- Undervoltage = 18V
  Overvoltage = 30V
  Current Limit = 1A
- R30, R31, R32 
  Configure OverV, UnderV
- V(uvpr)= R31+R32/(R30+R31+R32) *V(uv)
- V(ovpr)= R32/(R30+R31+R32) * V(ov)
- R34 = V(IMONmax)/(I(ILIM)*75*10^-6)
  V(IMONmax) = max ADC voltage = 5V

## Power pins joined to a net without a drawn wire
GPIO0-27_VDD: J2.39(B:GPIO0-27_VDD)
GPIO28-45_VDD: J2.41(B:GPIO28-45_VDD)
VC_TCK: J2.180(B:VC_TCK)
VC_TDO: J2.178(B:VC_TDO)
VDD33A_4: U3.49(VDD33A_4)
VDD33A_5: U3.51(VDD33A_5)
VDD33A_6: U3.54(VDD33A_6)
VDD33A_7: U3.57(VDD33A_7)
VDD33IO_4: U3.33(VDD33IO_4)
VDD33IO_5: U3.39(VDD33IO_5)

## Library data of the parts
C3-C29 C33-C35 C38-C46 C50-C53 C58 C60-C66 C68-C73 C75-C86 C88 C91 C96 C102 C103 C117 C121-C124 C126-C128 = rcl:C-US: CAPACITOR, American symbol; SPICEPREFIX: C
C118-C120 = adafruit:C-US: CAPACITOR, American symbol
C125 = rcl:CPOL-US: POLARIZED CAPACITOR, American symbol; DKPN: 732-8598-1-ND; SPICEPREFIX: C
C129 = rcl:CPOL-US: POLARIZED CAPACITOR, American symbol; DKPN: 732-8942-1-ND; SPICEPREFIX: C
D3 D5 D7 = led:LED: LED OSRAM: - CHIPLED LG R971, LG N971, LY N971, LG Q971, LY Q971, LO R971, LY R971 LH N974, LH R974 LS Q976, LO Q976, LY Q976 LO Q996 - Hyper CHIPLED LW Q18S LB Q993, LB Q99A, LB R99A - SideLED LS A670, LO A670, LY A670, LG A670, LP A670 LB A673, LV A673, LT A673, LW A673 LH A674 LY A675 LS A676, LA A676, LO A676, LY A676, LW A676 LS A679, LY A679, LG A679 - Hyper Micro SIDELED® LS Y876, LA Y876, LO Y876, LY Y876 LT Y87S - SmartLED LW L88C, LW L88S LB L89C, LB L89S, LG L890 LS L89K, LO L89K, LY L89K LS L896, LA L896, LO L896, LY L896 - TOPLED LS T670, LO T670, LY T670, LG T670, LP T670 LSG T670, LSP T670, LSY T670, LOP T670, LYG T670 LG T671, LOG T671, LSG T671 LB T673, LV T673, LT T673, LW T673 LH T674 LS T676, LA T676, LO T676, LY T676, LB T676, LH T676, LSB T676, LW T676 LB T67C, LV T67C, LT T67C, LS T67K, LO T67K, LY T67K, LW E67C LS E67B, LA E67B, LO E67B, LY E67B, LB E67C, LV E67C, LT E67C LW T67C LS T679, LY T679, LG T679 LS T770, LO T770, LY T770, LG T770, LP T770 LB T773, LV T773, LT T773, LW T773 LH T774 LS E675, LA E675, LY E675, LS T675 LS T776, LA T776, LO T776, LY T776, LB T776 LHGB T686 LT T68C, LB T68C - Hyper Mini TOPLED® LB M676 - Mini TOPLED Santana® LG M470 LS M47K, LO M47K, LY M47K Source: http://www.osram.convergy.de LUXEON: - LUMILED® LXK2-PW12-R00, LXK2-PW12-S00, LXK2-PW14-U00, LXK2-PW14-V00 LXK2-PM12-R00, LXK2-PM12-S00, LXK2-PM14-U00 LXK2-PE12-Q00, LXK2-PE12-R00, LXK2-PE12-S00, LXK2-PE14-T00, LXK2-PE14-U00 LXK2-PB12-K00, LXK2-PB12-L00, LXK2-PB12-M00, LXK2-PB14-N00, LXK2-PB14-P00, LXK2-PB14-Q00 LXK2-PR12-L00, LXK2-PR12-M00, LXK2-PR14-Q00, LXK2-PR14-R00 LXK2-PD12-Q00, LXK2-PD12-R00, LXK2-PD12-S00 LXK2-PH12-R00, LXK2-PH12-S00 LXK2-PL12-P00, LXK2-PL12-Q00, LXK2-PL12-R00 Source: www.luxeon.com KINGBRIGHT: KA-3528ASYC Source: www.kingbright.com
D10 = ethernet_poe:NTS260ESFT3G: Diode Schottky 2A Surface Mount SOD-123FL; DKPN: NTS260ESFT3GOSCT-ND
F1 = RoboJackets-Fuses:PTCFUSE: PTC fuses, resettable thermistors
F2 = ethernet_poe:0ZCG0050AF2C: Polymeric PTC Resettable Fuse 30V 1A Current Trip, 500mA Current Hold Surface Mount 1812 (4532 Metric), Concave; DKPN: 507-1762-1-ND
H1 H2 = holes:MOUNT-PAD-ROUND: MOUNTING PAD, round
J1 = USBR-A-D-F-O-TH:USBR-A-D-F-O-TH: HIGH RETENTION USB TYPE A DOUBLE ROW Check prices <https://pricing.snapeda.com/parts/USBR-A-D-F-O-TH/Samtec/view-part?ref=eda>; DESCRIPTION: USB-A (USB TYPE-A) USB 2.0 Receptacle Connector 8 Position Through Hole, Right Angle; DIGI-KEY_PART_NUMBER: SAM10376-ND; MF: Samtec; MP: USBR-A-D-F-O-TH; PACKAGE: None; PURCHASE-URL: https://pricing.snapeda.com/search/part/USBR-A-D-F-O-TH/?ref=eda
J2 = distributed-vision:RASPBERRRY_COMPUTE_CM3: RASPBERRY PI COMPUTE 3+ 16GB; DKPN: 1690-1031-ND
J3 = distributed-vision:XS10: Header for RPI Compute
J6 = distributed-vision:DM3D-SF: 10 (8 + 2) Position Card Connector Secure Digital - microSD™ Surface Mount, Right Angle Gold; DKPN: HR1941CT-ND
J7 = distributed-vision:10029449-111RLF: HDMI HDMI 1.4 Receptacle Connector 19 Position Surface Mount, Right Angle; Through Hole; DKPN: 609-4614-1-ND
J8 J9 = 1-84952-5:1-84952-5; COMMENT: 1-84952-5; DESCRIPTION: Conn FPC Connector SKT 15 POS 1mm Solder RA SMD T/R; DIGI-KEY_PART_NUMBER: A101391CT-ND; EU_ROHS_COMPLIANCE: Compliant; MF: TE Connectivity; MP: 1-84952-5; PACKAGE: None; PURCHASE-URL: https://pricing.snapeda.com/search/part/1-84952-5/?ref=eda
J12 = ethernet_poe:ARJM11C7-104-AB-EW2: 1 Port RJ45 Magjack Connector Through Hole 10/100 Base-T, AutoMDIX, Power over Ethernet (PoE); DKPN: 535-14148-ND
L1 L2 L4 L7 L8 = RoboJackets-Inductors:INDUCTOR_0805: Generic 0805 Inductor
L9 = ethernet_poe_v2.1:7447709470: WE-PD SMT Power Inductor Characteristics AECQ 200 Qualified Ultra low RDC and RAC Highest possible saturation current based on Ferrite Suitable for switching frequency up to 10MHz Temperature dependent parameter available on Redexpert Operating Temperature from -40°C to +125°C / +150°C Types WE-PD: Since always with low loss material, tight tolerances and high saturation behavior compared to other manufacturers in the market WE-PD Robust: Plastic base improves the mechanical stability and efficiency WE-PD Performance: MnZn core improves Saturation and RDC for highest efficiency Applications Switch Mode Power supplies from 0,1W up to 300W Integrated DC DC Converter Ideal for Switch Mode Power supplies with extreme high efficiency (>95%) <https://www.we-online.com/catalog/media/o14825v209%20Family_WE-PD.jpg> Details see: https://www.we-online.com/catalog/en/WE-PD/ Details see: https://katalog.we-online.com/en/pbs/WE-PD Updated by Yingchun,Shan 2019-07-25 2019 (C) Wurth Elektronik; DATASHEET-URL: https://www.we-online.com/catalog/datasheet/7447709470.pdf; DKPN: 732-1246-1-ND; FRES: 6.5MHz; IR: 3.8A; ISAT: 4.5A; MOUNT: SMT; PART-NUMBER: 7447709470; RDC-MAX: 60mOhm; RDC-TYP: 46mOhm; VERSION: Standard
Q1 = distributed-vision:AP2331SA-7: A single channel current-limited load switch; DKPN: AP2331SA-7DICT-ND
Q4 = RoboJackets-Discrete:BSS127: MOSFET N-CH 600V SOT23 with multiple current ratings; DKPN: BSS127S-7DICT-ND
Q5 = RoboJackets-Discrete:PSMN014-40YS: N-channel LFPAK 40V, 14 mOhm MOSFET; DKPN: 1727-4624-1-ND
Q7 = crystal:FA-: MHz RANGE CRYSTAL UNIT Source: Epson Toyocom
R2 R7-R11 R13 R14 R16 R20-R24 R49 R50 R53-R55 R73-R79 R82-R87 R96-R98 = rcl:R-US_: RESISTOR, American symbol; SPICEPREFIX: R
R26-R28 R30-R32 R39 R40 = RoboJackets-Resistors:ERJ-L06KF50MV: Current Sensing Resistor Datasheet <https://industrial.panasonic.com/cdbs/www-data/pdf/RDN0000/AOA0000C313.pdf>; DKPN: P50LLCT-ND
R80 R81 = adafruit:R-US_: RESISTOR, American symbol
RN42 RN43 = RoboJackets-Resistors:RA-4: Isolated Network Resistor Array x4
S2 = RoboJackets-Switches:34EWMSP12M6RT; DKPN: GH7540CT-ND
U1 = LM26420XMH:LM26420XMH: Frequency Synchronous Step-Down DCDC Regulator Check prices <https://pricing.snapeda.com/parts/LM26420XMH/NOPB/Texas%20Instruments/view-part?ref=eda>; AVAILABILITY: Good; DESCRIPTION: Dual 2 A, high-efficiency synchronous DC/DC converter 20-HTSSOP -40 to 125; MF: Texas Instruments; MP: LM26420XMH/NOPB; PACKAGE: HTSSOP-20 Texas Instruments; PRICE: None; PURCHASE-URL: https://pricing.snapeda.com/search/part/LM26420XMH/NOPB/?ref=eda
U3 = distributed-vision:LAN9513-JZX: USB to Ethernet. Datasheet link: https://ww1.microchip.com/downloads/en/DeviceDoc/00002305A.pdf; DKPN: LAN9513-JZX-ND
U4 = distributed-vision:ESD224: 14V Clamp 2A (8/20µs) Ipp Tvs Diode Surface Mount 10-USON (2.5x1); DKPN: 296-51107-1-ND
U8 U9 = distributed-vision:SP3003-02: TVS DIODE ARRAY; DKPN: F3302CT-ND
U11 = ethernet_poe:IFX91041: 1.8A DC/DC Step-Down Voltage Regulator 5.0V, 3.3V, or Adjustable Output; DKPN: IFX91041EJV50XUMA1CT-ND
U12 = ethernet_poe:TPS26600PWPR; DKPN: 296-47292-1-ND
X1 = RoboJackets-Connectors:JST-XH-02-PIN: JST XH Connector 2 Pin Wire to board connector. Pitch: 2,54 mm, (0.100") Number of pins: 2 Created by Rembrandt Electronics www.rembrandtelectronics.com

## Net classes
0 default: width 0.203 mm, drill 0.4 mm, clearance 0.203 mm
1 power: width 0.203 mm, drill 0.4 mm, clearance 0.203 mm to class 0, clearance 0.203 mm
2 ethernet: width 0.16 mm, drill 0.3 mm, clearance 0.152 mm
3 spi: width 0.207 mm, drill 0.35 mm